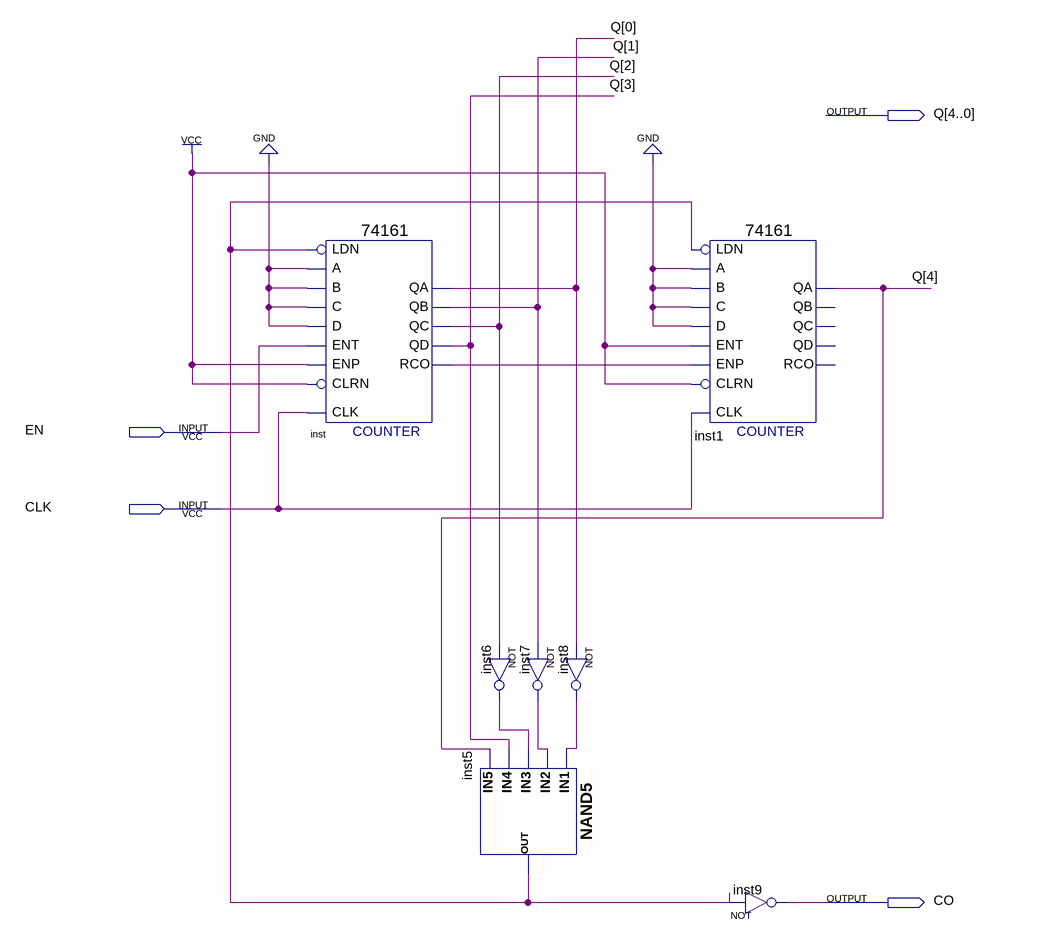
[diagram p0: schematic sheet]
// Quartus schematic M25Counter.bdf as structural Verilog: 7 symbols, 4 pins
module M25Counter (
  input  EN,
  input  CLK,
  output [4:0] Q,
  output CO
);

  wire inst5_out, inst6_out, inst7_out, inst8_out, inst_rco;

  \74161  inst (
    .CLRN(1'b1), .CLK(CLK), .ENP(1'b1), .LDN(inst5_out), .A(1'b0), .D(1'b0), .ENT(EN), .B(1'b0), .C(1'b0),
    .QD(Q[3]), .QC(Q[2]), .QB(Q[1]), .QA(Q[0]), .RCO(inst_rco));
  nand inst5 (inst5_out, inst8_out, inst7_out, inst6_out, Q[3], Q[4]);
  not inst6 (inst6_out, Q[2]);
  not inst7 (inst7_out, Q[1]);
  not inst8 (inst8_out, Q[0]);
  \74161  inst1 (
    .CLRN(1'b1), .CLK(CLK), .ENP(inst_rco), .LDN(inst5_out), .A(1'b0), .D(1'b0), .ENT(1'b1), .B(1'b0),
    .C(1'b0), .QA(Q[4]));  // open: QD, QC, QB, RCO
  not inst9 (CO, inst5_out);
endmodule
